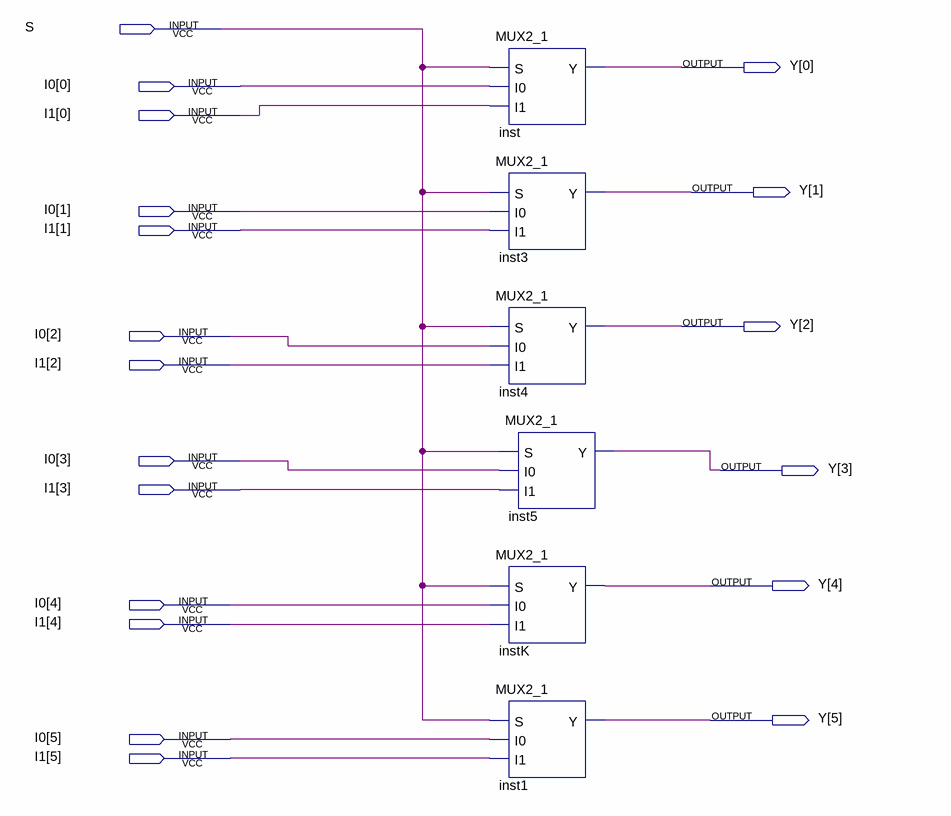
[diagram p0: schematic sheet]
// Quartus schematic MUX2_1_4BIT.bdf as structural Verilog: 6 symbols, 19 pins
module MUX2_1_4BIT (
  input  S,
  input  [5:0] I0,
  input  [5:0] I1,
  output [5:0] Y
);

  MUX2_1 inst (.S(S), .I0(I0[0]), .I1(I1[0]), .Y(Y[0]));
  MUX2_1 inst3 (.S(S), .I0(I0[1]), .I1(I1[1]), .Y(Y[1]));
  MUX2_1 inst4 (.S(S), .I0(I0[2]), .I1(I1[2]), .Y(Y[2]));
  MUX2_1 inst5 (.S(S), .I0(I0[3]), .I1(I1[3]), .Y(Y[3]));
  MUX2_1 instK (.S(S), .I0(I0[4]), .I1(I1[4]), .Y(Y[4]));
  MUX2_1 inst1 (.S(S), .I0(I0[5]), .I1(I1[5]), .Y(Y[5]));
endmodule
